# Altium schematic sheet 04_Output_Display.SchDoc
size A; SheetNumber: 1; SheetTotal: 1
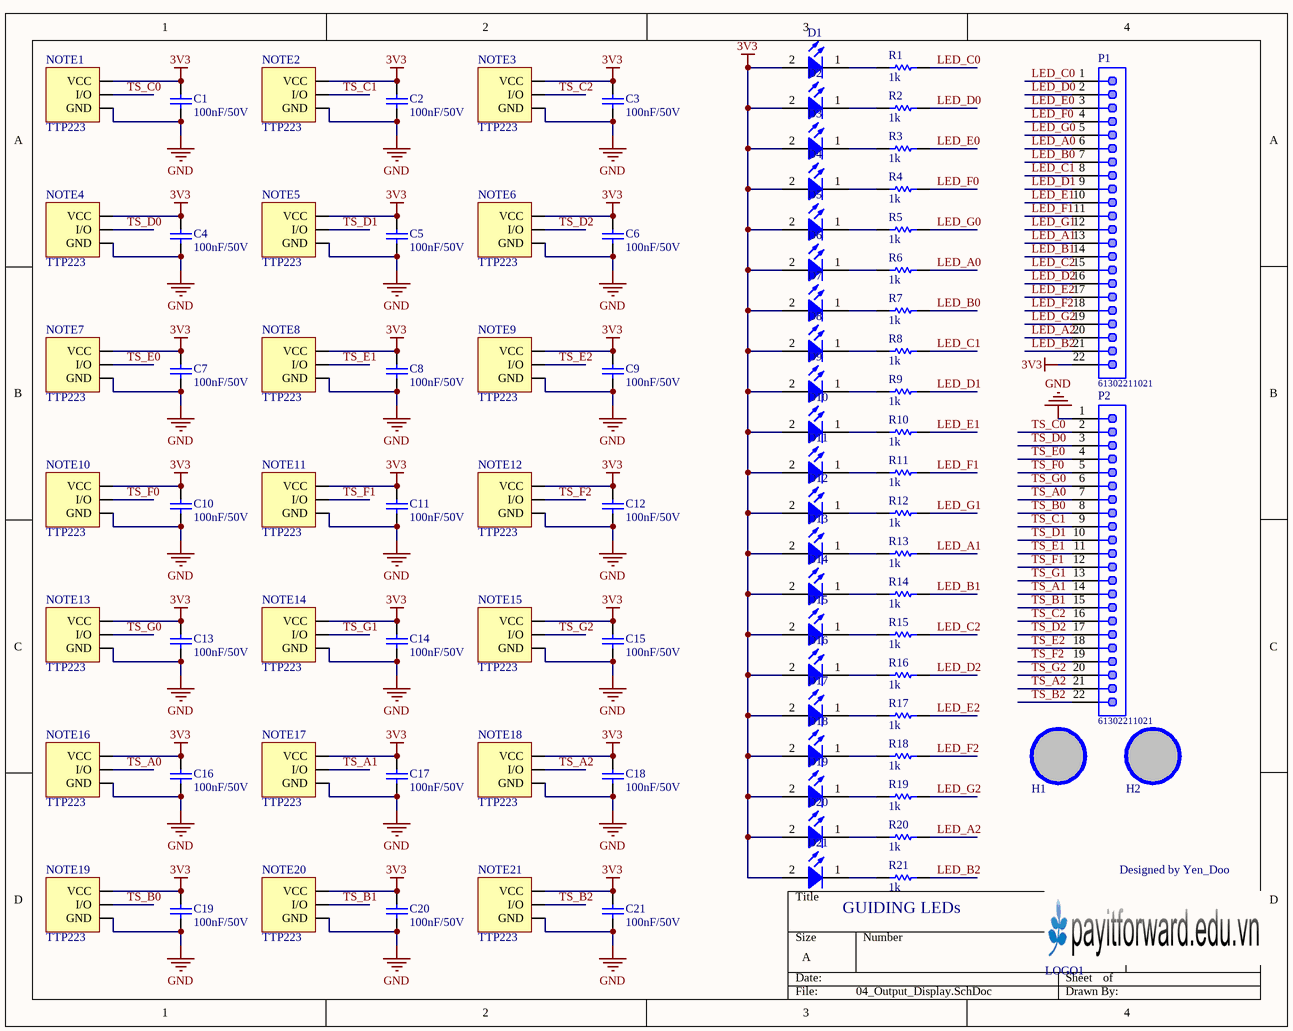
[diagram p0: 04_Output_Display.SchDoc]

## Parts
*1  LOGO_DOO  [Logo_Top_Overlay]  (value not drawn)
C1  value 100nF/50V  [CAP-SM-0805]  (hidden comment: Cap-100nF-50V-0805)
C2  value 100nF/50V  [CAP-SM-0805]  (hidden comment: Cap-100nF-50V-0805)
C3  value 100nF/50V  [CAP-SM-0805]  (hidden comment: Cap-100nF-50V-0805)
C4  value 100nF/50V  [CAP-SM-0805]  (hidden comment: Cap-100nF-50V-0805)
C5  value 100nF/50V  [CAP-SM-0805]  (hidden comment: Cap-100nF-50V-0805)
C6  value 100nF/50V  [CAP-SM-0805]  (hidden comment: Cap-100nF-50V-0805)
C7  value 100nF/50V  [CAP-SM-0805]  (hidden comment: Cap-100nF-50V-0805)
C8  value 100nF/50V  [CAP-SM-0805]  (hidden comment: Cap-100nF-50V-0805)
C9  value 100nF/50V  [CAP-SM-0805]  (hidden comment: Cap-100nF-50V-0805)
C10  value 100nF/50V  [CAP-SM-0805]  (hidden comment: Cap-100nF-50V-0805)
C11  value 100nF/50V  [CAP-SM-0805]  (hidden comment: Cap-100nF-50V-0805)
C12  value 100nF/50V  [CAP-SM-0805]  (hidden comment: Cap-100nF-50V-0805)
C13  value 100nF/50V  [CAP-SM-0805]  (hidden comment: Cap-100nF-50V-0805)
C14  value 100nF/50V  [CAP-SM-0805]  (hidden comment: Cap-100nF-50V-0805)
C15  value 100nF/50V  [CAP-SM-0805]  (hidden comment: Cap-100nF-50V-0805)
C16  value 100nF/50V  [CAP-SM-0805]  (hidden comment: Cap-100nF-50V-0805)
C17  value 100nF/50V  [CAP-SM-0805]  (hidden comment: Cap-100nF-50V-0805)
C18  value 100nF/50V  [CAP-SM-0805]  (hidden comment: Cap-100nF-50V-0805)
C19  value 100nF/50V  [CAP-SM-0805]  (hidden comment: Cap-100nF-50V-0805)
C20  value 100nF/50V  [CAP-SM-0805]  (hidden comment: Cap-100nF-50V-0805)
C21  value 100nF/50V  [CAP-SM-0805]  (hidden comment: Cap-100nF-50V-0805)
D1  Blue, 3.2V  [WL-SMCW_0805]  (value not drawn)
D2  Blue, 3.2V  [WL-SMCW_0805]  (value not drawn)
D3  Blue, 3.2V  [WL-SMCW_0805]  (value not drawn)
D4  Blue, 3.2V  [WL-SMCW_0805]  (value not drawn)
D5  Blue, 3.2V  [WL-SMCW_0805]  (value not drawn)
D6  Blue, 3.2V  [WL-SMCW_0805]  (value not drawn)
D7  Blue, 3.2V  [WL-SMCW_0805]  (value not drawn)
D8  Blue, 3.2V  [WL-SMCW_0805]  (value not drawn)
D9  Blue, 3.2V  [WL-SMCW_0805]  (value not drawn)
D10  Blue, 3.2V  [WL-SMCW_0805]  (value not drawn)
D11  Blue, 3.2V  [WL-SMCW_0805]  (value not drawn)
D12  Blue, 3.2V  [WL-SMCW_0805]  (value not drawn)
D13  Blue, 3.2V  [WL-SMCW_0805]  (value not drawn)
D14  Blue, 3.2V  [WL-SMCW_0805]  (value not drawn)
D15  Blue, 3.2V  [WL-SMCW_0805]  (value not drawn)
D16  Blue, 3.2V  [WL-SMCW_0805]  (value not drawn)
D17  Blue, 3.2V  [WL-SMCW_0805]  (value not drawn)
D18  Blue, 3.2V  [WL-SMCW_0805]  (value not drawn)
D19  Blue, 3.2V  [WL-SMCW_0805]  (value not drawn)
D20  Blue, 3.2V  [WL-SMCW_0805]  (value not drawn)
D21  Blue, 3.2V  [WL-SMCW_0805]  (value not drawn)
H1  Hole  [LO KHOAN 3MM]  (value not drawn)
H2  Hole  [LO KHOAN 3MM]  (value not drawn)
LOGO1  LOGO PIF  [PIF LOGO BIG SSTOP]  (value not drawn)
NOTE1  TTP223  [TTP223]
NOTE2  TTP223  [TTP223]
NOTE3  TTP223  [TTP223]
NOTE4  TTP223  [TTP223]
NOTE5  TTP223  [TTP223]
NOTE6  TTP223  [TTP223]
NOTE7  TTP223  [TTP223]
NOTE8  TTP223  [TTP223]
NOTE9  TTP223  [TTP223]
NOTE10  TTP223  [TTP223]
NOTE11  TTP223  [TTP223]
NOTE12  TTP223  [TTP223]
NOTE13  TTP223  [TTP223]
NOTE14  TTP223  [TTP223]
NOTE15  TTP223  [TTP223]
NOTE16  TTP223  [TTP223]
NOTE17  TTP223  [TTP223]
NOTE18  TTP223  [TTP223]
NOTE19  TTP223  [TTP223]
NOTE20  TTP223  [TTP223]
NOTE21  TTP223  [TTP223]
P1  61302211021  [61302211021]
P2  61302211021  [61302211021]
R1  value 1k  [RES-SM-0805]  (hidden comment: RESISTOR SMD)
R2  value 1k  [RES-SM-0805]  (hidden comment: RESISTOR SMD)
R3  value 1k  [RES-SM-0805]  (hidden comment: RESISTOR SMD)
R4  value 1k  [RES-SM-0805]  (hidden comment: RESISTOR SMD)
R5  value 1k  [RES-SM-0805]  (hidden comment: RESISTOR SMD)
R6  value 1k  [RES-SM-0805]  (hidden comment: RESISTOR SMD)
R7  value 1k  [RES-SM-0805]  (hidden comment: RESISTOR SMD)
R8  value 1k  [RES-SM-0805]  (hidden comment: RESISTOR SMD)
R9  value 1k  [RES-SM-0805]  (hidden comment: RESISTOR SMD)
R10  value 1k  [RES-SM-0805]  (hidden comment: RESISTOR SMD)
R11  value 1k  [RES-SM-0805]  (hidden comment: RESISTOR SMD)
R12  value 1k  [RES-SM-0805]  (hidden comment: RESISTOR SMD)
R13  value 1k  [RES-SM-0805]  (hidden comment: RESISTOR SMD)
R14  value 1k  [RES-SM-0805]  (hidden comment: RESISTOR SMD)
R15  value 1k  [RES-SM-0805]  (hidden comment: RESISTOR SMD)
R16  value 1k  [RES-SM-0805]  (hidden comment: RESISTOR SMD)
R17  value 1k  [RES-SM-0805]  (hidden comment: RESISTOR SMD)
R18  value 1k  [RES-SM-0805]  (hidden comment: RESISTOR SMD)
R19  value 1k  [RES-SM-0805]  (hidden comment: RESISTOR SMD)
R20  value 1k  [RES-SM-0805]  (hidden comment: RESISTOR SMD)
R21  value 1k  [RES-SM-0805]  (hidden comment: RESISTOR SMD)

## Nets
3V3: C1.2 C2.2 C3.2 C4.2 C5.2 C6.2 C7.2 C8.2 C9.2 C10.2 C11.2 C12.2 C13.2 C14.2 C15.2 C16.2 C17.2 C18.2 C19.2 C20.2 C21.2 D1.2(A) D2.2(A) D3.2(A) D4.2(A) D5.2(A) D6.2(A) D7.2(A) D8.2(A) D9.2(A) D10.2(A) D11.2(A) D12.2(A) D13.2(A) D14.2(A) D15.2(A) D16.2(A) D17.2(A) D18.2(A) D19.2(A) D20.2(A) D21.2(A) NOTE1.3(VCC) NOTE2.3(VCC) NOTE3.3(VCC) NOTE4.3(VCC) NOTE5.3(VCC) NOTE6.3(VCC) NOTE7.3(VCC) NOTE8.3(VCC) NOTE9.3(VCC) NOTE10.3(VCC) NOTE11.3(VCC) NOTE12.3(VCC) NOTE13.3(VCC) NOTE14.3(VCC) NOTE15.3(VCC) NOTE16.3(VCC) NOTE17.3(VCC) NOTE18.3(VCC) NOTE19.3(VCC) NOTE20.3(VCC) NOTE21.3(VCC) P1.22
GND: C1.1 C2.1 C3.1 C4.1 C5.1 C6.1 C7.1 C8.1 C9.1 C10.1 C11.1 C12.1 C13.1 C14.1 C15.1 C16.1 C17.1 C18.1 C19.1 C20.1 C21.1 NOTE1.1(GND) NOTE2.1(GND) NOTE3.1(GND) NOTE4.1(GND) NOTE5.1(GND) NOTE6.1(GND) NOTE7.1(GND) NOTE8.1(GND) NOTE9.1(GND) NOTE10.1(GND) NOTE11.1(GND) NOTE12.1(GND) NOTE13.1(GND) NOTE14.1(GND) NOTE15.1(GND) NOTE16.1(GND) NOTE17.1(GND) NOTE18.1(GND) NOTE19.1(GND) NOTE20.1(GND) NOTE21.1(GND) P2.1
LED_A0: P1.6 R6.1
LED_A1: P1.13 R13.1
LED_A2: P1.20 R20.1
LED_B0: P1.7 R7.1
LED_B1: P1.14 R14.1
LED_B2: P1.21 R21.1
LED_C0: P1.1 R1.1
LED_C1: P1.8 R8.1
LED_C2: P1.15 R15.1
LED_D0: P1.2 R2.1
LED_D1: P1.9 R9.1
LED_D2: P1.16 R16.1
LED_E0: P1.3 R3.1
LED_E1: P1.10 R10.1
LED_E2: P1.17 R17.1
LED_F0: P1.4 R4.1
LED_F1: P1.11 R11.1
LED_F2: P1.18 R18.1
LED_G0: P1.5 R5.1
LED_G1: P1.12 R12.1
LED_G2: P1.19 R19.1
TS_A0: NOTE16.2(I/O) P2.7
TS_A1: NOTE17.2(I/O) P2.14
TS_A2: NOTE18.2(I/O) P2.21
TS_B0: NOTE19.2(I/O) P2.8
TS_B1: NOTE20.2(I/O) P2.15
TS_B2: NOTE21.2(I/O) P2.22
TS_C0: NOTE1.2(I/O) P2.2
TS_C1: NOTE2.2(I/O) P2.9
TS_C2: NOTE3.2(I/O) P2.16
TS_D0: NOTE4.2(I/O) P2.3
TS_D1: NOTE5.2(I/O) P2.10
TS_D2: NOTE6.2(I/O) P2.17
TS_E0: NOTE7.2(I/O) P2.4
TS_E1: NOTE8.2(I/O) P2.11
TS_E2: NOTE9.2(I/O) P2.18
TS_F0: NOTE10.2(I/O) P2.5
TS_F1: NOTE11.2(I/O) P2.12
TS_F2: NOTE12.2(I/O) P2.19
TS_G0: NOTE13.2(I/O) P2.6
TS_G1: NOTE14.2(I/O) P2.13
TS_G2: NOTE15.2(I/O) P2.20
NetD1_1: D1.1(K) R1.2
NetD2_1: D2.1(K) R2.2
NetD3_1: D3.1(K) R3.2
NetD4_1: D4.1(K) R4.2
NetD5_1: D5.1(K) R5.2
NetD6_1: D6.1(K) R6.2
NetD7_1: D7.1(K) R7.2
NetD8_1: D8.1(K) R8.2
NetD9_1: D9.1(K) R9.2
NetD10_1: D10.1(K) R10.2
NetD11_1: D11.1(K) R11.2
NetD12_1: D12.1(K) R12.2
NetD13_1: D13.1(K) R13.2
NetD14_1: D14.1(K) R14.2
NetD15_1: D15.1(K) R15.2
NetD16_1: D16.1(K) R16.2
NetD17_1: D17.1(K) R17.2
NetD18_1: D18.1(K) R18.2
NetD19_1: D19.1(K) R19.2
NetD20_1: D20.1(K) R20.2
NetD21_1: D21.1(K) R21.2

Not connected (* = marked no-connect by the designer): H1 1; H2 1

## Notes on the sheet
- GUIDING LEDs
- (in symbol LOGO_DOO) Designed by Yen_Doo

## Library data of the parts
C1-C21 = Cap-100nF-50V-0805: CAP CER 0.1UF 50V Y5V 0805; Manufacturer: Samsung Electro-Mechanics; Manufacturer Part Number: CL21F104ZBCNNNC; Local Supplier: thegioiic; Local Supplier Link: https://thegioiic.com/products/tu-100nf-0-1uf-50v-0805; Supplier 1: Digikey; Supplier 1 Part Number: 1276-1007-1-ND; Supplier 1 Link: https://www.digikey.com/product-detail/en/samsung-electro-mechanics/CL21F104ZBCNNNC/1276-1007-1-ND/3889093
D1-D21 = 150080BS75000: WL-SMCW SMT Mono-color Chip LED Waterclear, size 0805, Blue, 3.2V, 140deg; Chip Technology: InGaN; Dominant Wavelength typ.: 470nm; Luminous Intensity typ.: 145mcd; Peak Wavelength typ.: 465nm; Viewing Angle: 140deg; ComponentLink1Description: Manufacturer; ComponentLink1URL: http://www.we-online.de; ComponentLink2URL: https://www.we-online.com/catalog/datasheet/150080BS75000.pdf; ComponentLink2Description: Datasheet; Forward Voltage typ.: 3.2V; Emitting Color: Blue; Mounting Technology: SMT; Operating Temperature: -40 to +85degC; Published Date: December 2019; Part Number: 150080BS75000; Packaging: Tape and Reel; Size: 0805; Publisher: Wurth Elektronik
H1 H2 = Hole: Hole 3mm
P1 P2 = 61302211021: WR-PHD Pin Header, THT, pitch 2.54mm, Single Row, Angled, 22p; Manufacturer: Wurth Elektronik; Pin Number: 22; Rated Current: 3A; Working Voltage: 250VAC; Withstanding Voltage: 500VAC; Contact Resistance: 20mOhm; ComponentLink1Description: Manufacturer; ComponentLink1URL: http://www.we-online.de; ComponentLink2Description: Datasheet; ComponentLink2URL: https://www.we-online.com/catalog/datasheet/61302211021.pdf; Manufacturer Part Number: 61302211021; Published Date: May 2020; Pitch: 2.54mm; Operating Temperature: -40 to +105degC; Mounting Technology: THT; Packaging: Bag; Gender: Pin Header; Row Number: Single; Orientation: Angled
R1-R21 = RESISTOR SMD: Resistor